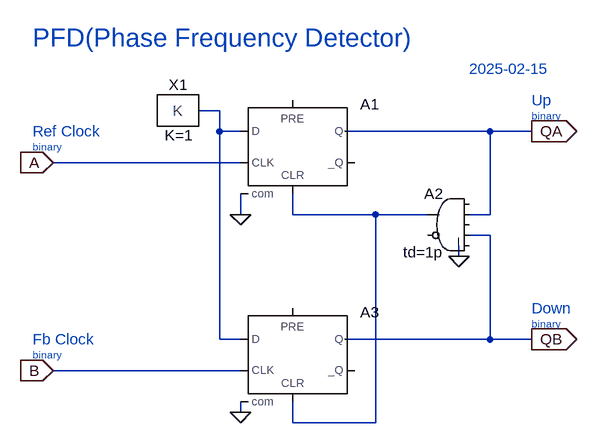
[diagram p0: schematic PFD.asc]
PFD.asc, the LTspice schematic file:
Version 4
SHEET 1 880 680
WIRE 192 112 160 112
WIRE 192 144 192 112
WIRE 224 144 192 144
WIRE 608 144 384 144
WIRE 672 144 608 144
WIRE 224 192 -64 192
WIRE 224 272 224 240
WIRE 304 272 304 240
WIRE 432 272 304 272
WIRE 512 272 432 272
WIRE 608 272 608 144
WIRE 608 272 576 272
WIRE 608 304 576 304
WIRE 560 336 560 320
WIRE 192 464 192 144
WIRE 224 464 192 464
WIRE 608 464 608 304
WIRE 608 464 384 464
WIRE 672 464 608 464
WIRE 224 512 -64 512
WIRE 224 576 224 560
WIRE 304 592 304 560
WIRE 432 592 432 272
WIRE 432 592 304 592
FLAG -64 192 A
IOPIN -64 192 In
FLAG -64 512 B
IOPIN -64 512 In
FLAG 224 272 0
FLAG 224 576 0
FLAG 560 336 0
FLAG 672 144 QA
IOPIN 672 144 Out
FLAG 672 464 QB
IOPIN 672 464 Out
SYMBOL Digital\\dflop 304 96 R0
SYMATTR InstName A1
SYMBOL Digital\\and 544 224 M0
WINDOW 3 8 106 Left 2
SYMATTR Value td=1p
SYMATTR InstName A2
SYMBOL Digital\\dflop 304 416 R0
SYMATTR InstName A3
SYMBOL PowerSim\\CONST 128 112 R0
WINDOW 39 1 54 Bottom 2
SYMATTR InstName X1
TEXT -96 0 Left 4 ;PFD(Phase Frequency Detector)
TEXT 576 48 Left 2 ;2025-02-15
TEXT -96 168 Left 1 ;binary
TEXT -96 488 Left 1 ;binary
TEXT -96 144 Left 2 ;Ref Clock
TEXT -96 464 Left 2 ;Fb Clock
TEXT 672 96 Left 2 ;Up
TEXT 672 416 Left 2 ;Down
TEXT 672 120 Left 1 ;binary
TEXT 672 440 Left 1 ;binary

The netlist it stands for:
* PFD.asc
A1 N001 0 A 0 N002 0 QA 0 DFLOP
A2 0 QA 0 QB 0 0 N002 0 AND td=1p
A3 N001 0 B 0 N002 0 QB 0 DFLOP
XX1 N001 CONST K=1  ; pins K
* PFD(Phase Frequency Detector)
* 2025-02-15
* binary
* binary
* Ref Clock
* Fb Clock
* Up
* Down
* binary
* binary
.backanno
.end